# Altium schematic sheet 12_Supply.SchDoc
size Tabloid
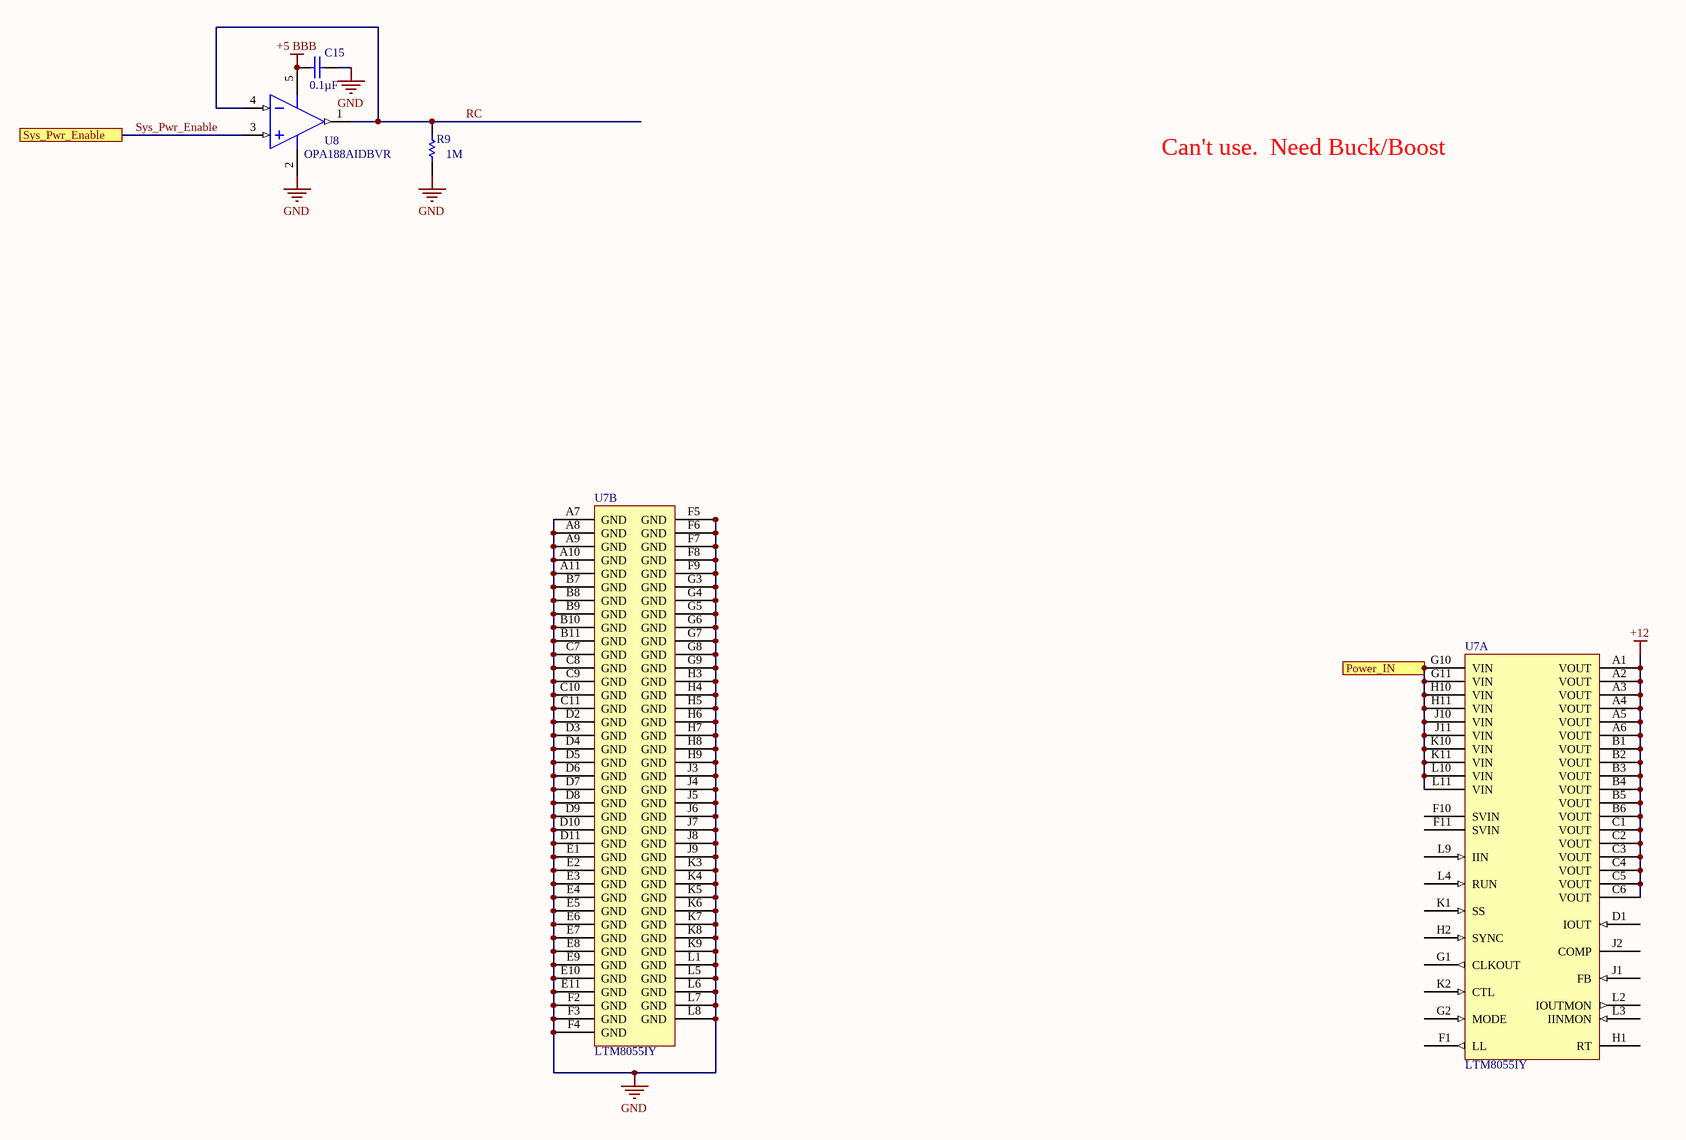
[diagram p0: 12_Supply.SchDoc]

## Parts
C15  Capacitance: 0.1µF  [CAPC0805(2012)145_N]  (hidden comment: CAP CER 0.1UF 16V X7R 0805)
R9  1M  [RESC0402(1005)_L]
U7  LTM8055IY  [LT-BGA-121-15000X15000X4920]  (parts A,B of 2)
U8  OPA188AIDBVR  [DBV0005A_M]

## Ports
Power_IN, Sys_Pwr_Enable

## Nets
+5 BBB: C15.1 U8.5(V+)
+12: U7.A1(VOUT) U7.A2(VOUT) U7.A3(VOUT) U7.A4(VOUT) U7.A5(VOUT) U7.A6(VOUT) U7.B1(VOUT) U7.B2(VOUT) U7.B3(VOUT) U7.B4(VOUT) U7.B5(VOUT) U7.B6(VOUT) U7.C1(VOUT) U7.C2(VOUT) U7.C3(VOUT) U7.C4(VOUT) U7.C5(VOUT) U7.C6(VOUT)
GND: C15.2 R9.1 U7.A7(GND) U7.A8(GND) U7.A9(GND) U7.A10(GND) U7.A11(GND) U7.B7(GND) U7.B8(GND) U7.B9(GND) U7.B10(GND) U7.B11(GND) U7.C7(GND) U7.C8(GND) U7.C9(GND) U7.C10(GND) U7.C11(GND) U7.D2(GND) U7.D3(GND) U7.D4(GND) U7.D5(GND) U7.D6(GND) U7.D7(GND) U7.D8(GND) U7.D9(GND) U7.D10(GND) U7.D11(GND) U7.E1(GND) U7.E2(GND) U7.E3(GND) U7.E4(GND) U7.E5(GND) U7.E6(GND) U7.E7(GND) U7.E8(GND) U7.E9(GND) U7.E10(GND) U7.E11(GND) U7.F2(GND) U7.F3(GND) U7.F4(GND) U7.F5(GND) U7.F6(GND) U7.F7(GND) U7.F8(GND) U7.F9(GND) U7.G3(GND) U7.G4(GND) U7.G5(GND) U7.G6(GND) U7.G7(GND) U7.G8(GND) U7.G9(GND) U7.H3(GND) U7.H4(GND) U7.H5(GND) U7.H6(GND) U7.H7(GND) U7.H8(GND) U7.H9(GND) U7.J3(GND) U7.J4(GND) U7.J5(GND) U7.J6(GND) U7.J7(GND) U7.J8(GND) U7.J9(GND) U7.K3(GND) U7.K4(GND) U7.K5(GND) U7.K6(GND) U7.K7(GND) U7.K8(GND) U7.K9(GND) U7.L1(GND) U7.L5(GND) U7.L6(GND) U7.L7(GND) U7.L8(GND) U8.2(V-)
Power_IN: U7.G10(VIN) U7.G11(VIN) U7.H10(VIN) U7.H11(VIN) U7.J10(VIN) U7.J11(VIN) U7.K10(VIN) U7.K11(VIN) U7.L10(VIN) U7.L11(VIN) ; port Power_IN
RC: R9.2 U8.1(OUT) U8.4(IN-)
Sys_Pwr_Enable: U8.3(IN+) ; port Sys_Pwr_Enable

Not connected (* = marked no-connect by the designer): U7 D1(IOUT) F1(LL) F10(SVIN) F11(SVIN) G1(CLKOUT) G2(MODE) H1(RT) H2(SYNC) J1(FB) J2(COMP) K1(SS) K2(CTL) L2(IOUTMON) L3(IINMON) L4(RUN) L9(IIN)

## Notes on the sheet
- Can't use.  Need Buck/Boost
- Title
- Size:
- Date:
- Tabloid
- Number:
- Time:
- Revision:
- Sheet
- of
- ZLS Corporation
- 7801 North Lamar Blvd.
- Suite E-184
- Austin, Texas 78752  USA
- (512) 453-0288
- File:

## Library data of the parts
C15 = CMP-1036-04795-1: Manufacturer: Murata Electronics North America; Manufacturer Part Number: GRM219R71C104KA01D; Tolerance: ±10%; Voltage - Rated: 25V; Supplier Part Number 1: 490-1673-6-ND; Temperature Coefficient: X7R; Thickness (Max): 0.053" (1.35mm); Supplier 2: Digi-Key; Supplier Part Number 2: 490-1683-6-ND; RoHS: RoHS Compliant; Category: Capacitors; Stock 2: 245331; Pricing 2: 1=0.14, 10=0.098, 100=0.0462, 500=0.0324, 1000=0.02683 (USD); Packaging: Digi-Reel®; Part Status: Active; Operating Temperature: -55°C ~ 125°C; Features: -; Ratings: -; Applications: General Purpose; Mounting Type: Surface Mount, MLCC; Package / Case: 0805 (2012 Metric); Size / Dimension: 0.079" L x 0.049" W (2.00mm x 1.25mm); Height - Seated (Max): -; Lead Spacing: -; Lead Style: -; ComponentLink1URL: http://www.murata.com/~/media/webrenewal/support/library/catalog/products/capacitor/mlcc/c02e.ashx; ComponentLink1Description: http://www.murata.com/~/media/webrenewal/support/library/catalog/products/capacitor/mlcc/c02e.ashx
R9 = CMP-1011-00927-1: Tolerance: ±1%; Temperature Coefficient: ±100ppm/°C; Supplier Part Number 1: YAG3220CT-ND; Supplier Device Package: 0402
U7 = CMP-2000-06614-1: Buck-Boost uModule Regulator, 8.5 A, 5 to 36 V, -40 to 125 degC, 121-Ball BGA, RoHS, Tray; Manufacturer: LinearTechnology; Current - Output (Max): 8.5A; Number of Outputs: 1; Efficiency: 97.5%; Voltage - Input (Max): 36V; Package Version: Rev. A, 11/2012; Voltage - Output 1: 1.2~36V; Voltage - Input (Min): 5V; Operating Temperature: -40°C~125°C; Voltage - Output 3: -; Datasheet Version: Rev. A, 01/2016; Power (Watts) - Manufacture Series: -; Series: µModule®; Manufacturer URL: http://www.linear.com/; Datasheet URL: http://cds.linear.com/docs/en/datasheet/8055fa.pdf; Type: Non-IsolatedPoLModule; Voltage - Output 2: -; Mounting Type: SurfaceMount; Packaging: Tray; Mounting Technology: SurfaceMount; Package URL: http://www.linear.com/docs/41075; Features: OTP; Power (Watts) - Max: -; Package Reference: BGA-121; Category: PowerSupplies-BoardMount; Package / Case: 121-BGA; Voltage - Isolation: -; Package Description: 121-Ball BGA, Body 15 x 15 mm, Pitch 1.27 mm; Applications: ITE(Commercial); Family: DCDCConverters; PartId: 1
U8 = CMP-0809-00005-2: Precision, Low Noise, Rail-to-Rail Output, Zero-Drift Operational Amplifier, 4 to 36 V, -40 to 125 degC, 5-pin SOT23 (DBV5), Green (RoHS & no Sb/Br); Manufacturer: Texas Instruments; Total Supply Voltage(Min)(+5V is 5, +/-5V is 10): 4; Offset Drift(Typ)(uV/C): 0.03; Rating: Catalog; SubFamily: Zero Drift Precision Amplifier; GBW(Typ)(MHz): 2; Slew Rate(Typ)(V/us): 0.8; Number of Channels: 1; CMRR(Min)(dB): 120; Iq per channel(Max)(mA): 0.51; Total Supply Voltage(Max)(+5V is 5, +/-5V is 10): 36; PartNumber: OPA188AIDBVR; ComponentLink2Description: Datasheet; ComponentLink2URL: http://www.ti.com/lit/ds/symlink/opa188.pdf; ComponentLink1Description: Manufacturer URL; Mounting Technology: Surface Mount; Eco-Plan: Green (RoHS & no Sb/Br); ComponentLink1URL: http://www.ti.com/; PackageVersion: 4073253-4/K, 03/2006; DatasheetVersion: SBOS642A; ComponentLink3Description: Package Specification; PackageReference: DBV0005A; ComponentLink3URL: http://www.ti.com/litv/pdf/mpds018i; PackageDescription: 5-Pin Plastic Small Outline, Body 1.6 x 2.9 mm, Pitch 0.95 mm; Code_JEDEC: MO-178